# EAGLE design RTI-Dome-wire (EAGLE 7.7.0)
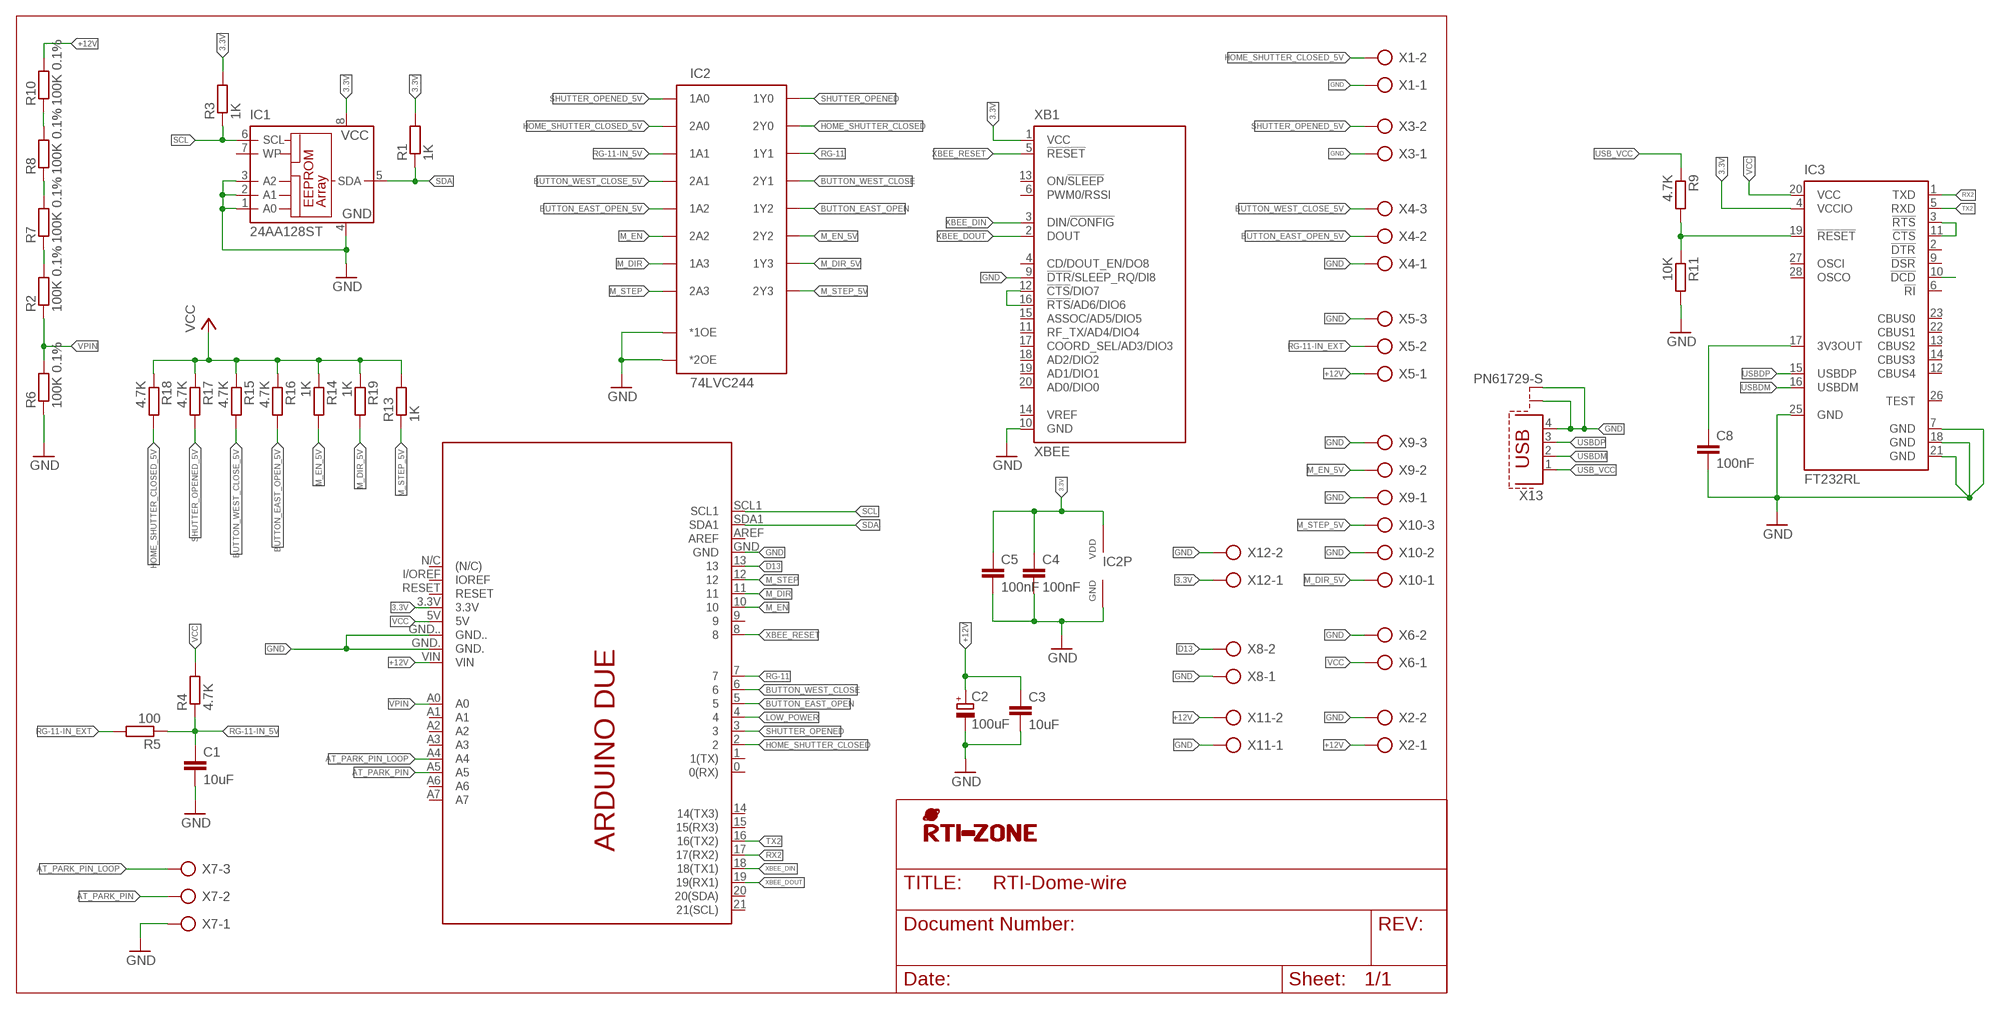
[diagram p0: schematic, sheet 1]

## Parts
C1  10uF  C-EU'0805'  [C0805]
C2  100uF  CPOL-EU  [UD-10X10_NICHICON]
C3  10uF  C-EU'0805'  [C0805]
C4  100nF  C-EU'0805'  [C0805]
C5  100nF  C-EU'0805'  [C0805]
C8  100nF  C-EU'0805'  [C0805]
IC1  24AA128ST  [TSSOP8]
IC2  74LVC244  [TSSOP20]
IC3  FT232RL  [SSOP28]
PCB1  ARDUINO_DUE_SHIELD_SHORT  [ARDUINO_DUE_SHIELD_SHORT]
R1  1K  R-EU'0805'  [R0805]
R2  100K 0.1%  R-EU'0805'  [R0805]
R3  1K  R-EU'0805'  [R0805]
R4  4.7K  R-EU'0805'  [R0805]
R5  100  R-EU'0805'  [R0805]
R6  100K 0.1%  R-EU'0805'  [R0805]
R7  100K 0.1%  R-EU'0805'  [R0805]
R8  100K 0.1%  R-EU'0805'  [R0805]
R9  4.7K  R-EU'0805'  [R0805]
R10  100K 0.1%  R-EU'0805'  [R0805]
R11  10K  R-EU'0805'  [R0805]
R13  1K  R-EU'0805'  [R0805]
R14  1K  R-EU'0805'  [R0805]
R15  4.7K  R-EU'0805'  [R0805]
R16  4.7K  R-EU'0805'  [R0805]
R17  4.7K  R-EU'0805'  [R0805]
R18  4.7K  R-EU'0805'  [R0805]
R19  1K  R-EU'0805'  [R0805]
U$4  RTI-LOGO_BIG  [LOGO_BIG]
X1  AK500/2  [AK500/2]
X2  AK500/2  [AK500/2]
X3  AK500/2  [AK500/2]
X4  AK500/3  [AK500/3]
X5  AK500/3  [AK500/3]
X6  AK500/2  [AK500/2]
X7  AK500/3  [AK500/3]
X8  AK500/2  [AK500/2]
X9  AK500/3  [AK500/3]
X10  AK500/3  [AK500/3]
X11  AK500/2  [AK500/2]
X12  AK500/2  [AK500/2]
X13  PN61729-S  [PN61729-S]
XB1  XBEE  [XBEE]

## Nets
3.3V: C4.1 C5.1 IC1.8(VCC) IC2.P$20(VDD) IC3.4(VCCIO) PCB1.3.3V R1.2 R3.2 X12.1 XB1.1(VCC)
+12V [+12V]: C2.+ C3.1 PCB1.VIN R10.2 X2.1 X5.1 X11.2
AT_PARK_PIN: PCB1.A5 X7.2
AT_PARK_PIN_LOOP: PCB1.A4 X7.3
BUTTON_EAST_OPEN: IC2.P$14(1Y2) PCB1.5
BUTTON_EAST_OPEN_5V: IC2.P$6(1A2) R16.2 X4.2
BUTTON_WEST_CLOSE: IC2.P$5(2Y1) PCB1.6
BUTTON_WEST_CLOSE_5V: IC2.P$15(2A1) R15.2 X4.3
D13: PCB1.13 X8.2
GND [GND]: C1.2 C2.- C3.2 C4.2 C5.2 C8.2 IC1.1(A0) IC1.2(A1) IC1.3(A2) IC1.4(GND) IC2.P$1(*1OE) IC2.P$10(GND) IC2.P$19(*2OE) IC3.7(GND) IC3.18(GND) IC3.21(GND) IC3.25(GND) PCB1.GND PCB1.GND. PCB1.GND.. R6.1 R11.2 X1.1 X2.2 X3.1 X4.1 X5.3 X6.2 X7.1 X8.1 X9.1 X9.3 X10.2 X11.1 X12.2 X13.4 X13.S1 X13.S2 XB1.9(!DTR!/SLEEP_RQ/DI8) XB1.10(GND)
HOME_SHUTTER_CLOSED: IC2.P$3(2Y0) PCB1.2
HOME_SHUTTER_CLOSED_5V: IC2.P$17(2A0) R18.2 X1.2
LOW_POWER: PCB1.4
M_DIR: IC2.P$8(1A3) PCB1.11
M_DIR_5V: IC2.P$12(1Y3) R19.2 X10.1
M_EN: IC2.P$13(2A2) PCB1.10
M_EN_5V: IC2.P$7(2Y2) R14.2 X9.2
M_STEP: IC2.P$11(2A3) PCB1.12
M_STEP_5V: IC2.P$9(2Y3) R13.1 X10.3
N$1: IC3.19(!RESET) R9.2 R11.1
N$2: R7.2 R8.1
N$3: R8.2 R10.1
N$4: IC3.3(!RTS) IC3.11(!CTS)
N$5: R2.2 R7.1
N$6: C8.1 IC3.17(3V3OUT)
N$9: XB1.12(!CTS!/DIO7) XB1.16(!RTS!/AD6/DIO6)
N$21: IC3.10(!DCD)
RG-11: IC2.P$16(1Y1) PCB1.7
RG-11-IN_5V: C1.1 IC2.P$4(1A1) R4.1 R5.1
RG-11-IN_EXT: R5.2 X5.2
RX2: IC3.1(TXD) PCB1.17(17(RX2))
SCL: IC1.6(SCL) PCB1.SCL1 R3.1
SDA: IC1.5(SDA) PCB1.SDA1 R1.1
SHUTTER_OPENED: IC2.P$18(1Y0) PCB1.3
SHUTTER_OPENED_5V: IC2.P$2(1A0) R17.2 X3.2
TX2: IC3.5(RXD) PCB1.16(16(TX2))
USB_VCC: R9.1 X13.1
USBDM: IC3.16(USBDM) X13.2
USBDP: IC3.15(USBDP) X13.3
VCC: IC3.20(VCC) PCB1.5V R4.2 R13.2 R14.1 R15.1 R16.1 R17.1 R18.1 R19.1 X6.1
VPIN: PCB1.A0 R2.1 R6.2
XBEE_DIN: PCB1.18(18(TX1)) XB1.3(DIN/!CONFIG)
XBEE_DOUT: PCB1.19(19(RX1)) XB1.2(DOUT)
XBEE_RESET: PCB1.8 XB1.5(!RESET)
Unconnected: IC1.7(WP) IC3.2(!DTR) IC3.6(!RI) IC3.9(!DSR) IC3.12(CBUS4) IC3.13(CBUS2) IC3.14(CBUS3) IC3.22(CBUS1) IC3.23(CBUS0) IC3.26(TEST) IC3.27(OSCI) IC3.28(OSCO) PCB1.0(0(RX)) PCB1.1(1(TX)) PCB1.9 PCB1.14(14(TX3)) PCB1.15(15(RX3)) PCB1.20(20(SDA)) PCB1.21(21(SCL)) PCB1.A1 PCB1.A2 PCB1.A3 PCB1.A6 PCB1.A7 PCB1.AREF PCB1.I/OREF(IOREF) PCB1.N/C((N/C)) PCB1.RESET XB1.4(CD/DOUT_EN/DO8) XB1.6(PWM0/RSSI) XB1.11(RF_TX/AD4/DIO4) XB1.13(ON/!SLEEP) XB1.14(VREF) XB1.15(ASSOC/AD5/DIO5) XB1.17(COORD_SEL/AD3/DIO3) XB1.18(AD2/DIO2) XB1.19(AD1/DIO1) XB1.20(AD0/DIO0)

## Library data of the parts
C1 C3-C5 C8 = rti:C-EU
C2 = rti:CPOL-EU
IC1 = microchip:24*: Serial EEPROM I2C; MF: MICROCHIP; MPN: 24AA128-I/ST; OC_FARNELL: unknown; OC_NEWARK: 92C6843
IC2 = rti:74*244
IC3 = ftdichip:FT232R: Source: http://www.ftdichip.com/Documents/DataSheets/DS_FT232R_v104.pdf; MPN: FT232RL; OC_FARNELL: 1146032; OC_NEWARK: 91K9918
PCB1 = arduino_shield:ARDUINO_DUE_SHIELD_SHORT: Device for representing an Arduino Due board with a footprint in an EAGLE design. Created by Dave Young for Element14. More EAGLE documentation at: http://www.element14.com/community/community/knode/cadsoft_eagle
R1-R11 R13-R19 = rti:R-EU
U$4 = rti:RTI-LOGO
X1-X3 X6 X8 X11 X12 = con-ptr500:AK500/2: CONNECTOR; OC_FARNELL: unknown; OC_NEWARK: unknown
X4 X5 X7 X9 X10 = con-ptr500:AK500/3: CONNECTOR; OC_FARNELL: unknown; OC_NEWARK: unknown
X13 = con-berg:PN61729-S: BERG USB connector; OC_FARNELL: unknown; OC_NEWARK: unknown
XB1 = maxstream:XBEE: XBee (TM) /XBee-PRO(TM) OEM RF Modules Source: MaxStream, Inc. xbee_productmanual.pdf; MPN: XBP24-Z7UIT-004; OC_FARNELL: 1751799; OC_NEWARK: 34R5507

## Net classes
0 default: width 0.254 mm, drill 0.3 mm, clearance 0.203 mm
1 +12V: width 0.254 mm, drill 0.3 mm, clearance 0.203 mm
2 GND: width 0.254 mm, drill 0.3 mm, clearance 0.203 mm

## Board
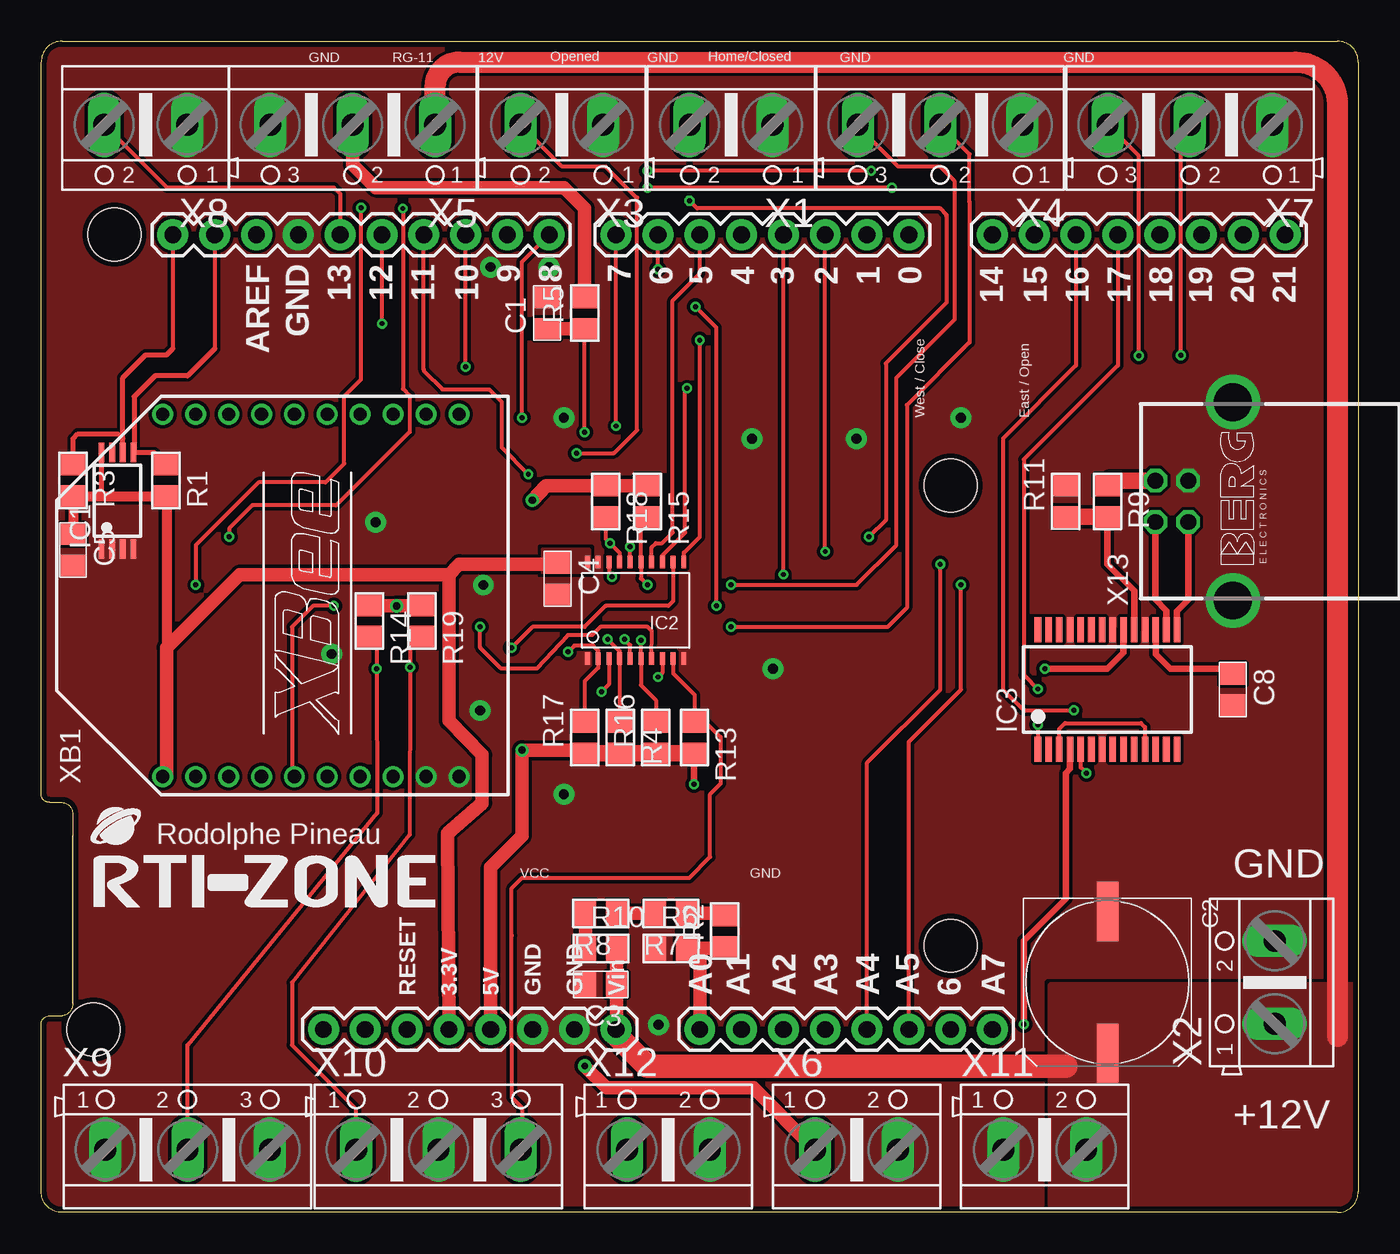
[diagram p1: board, top side]
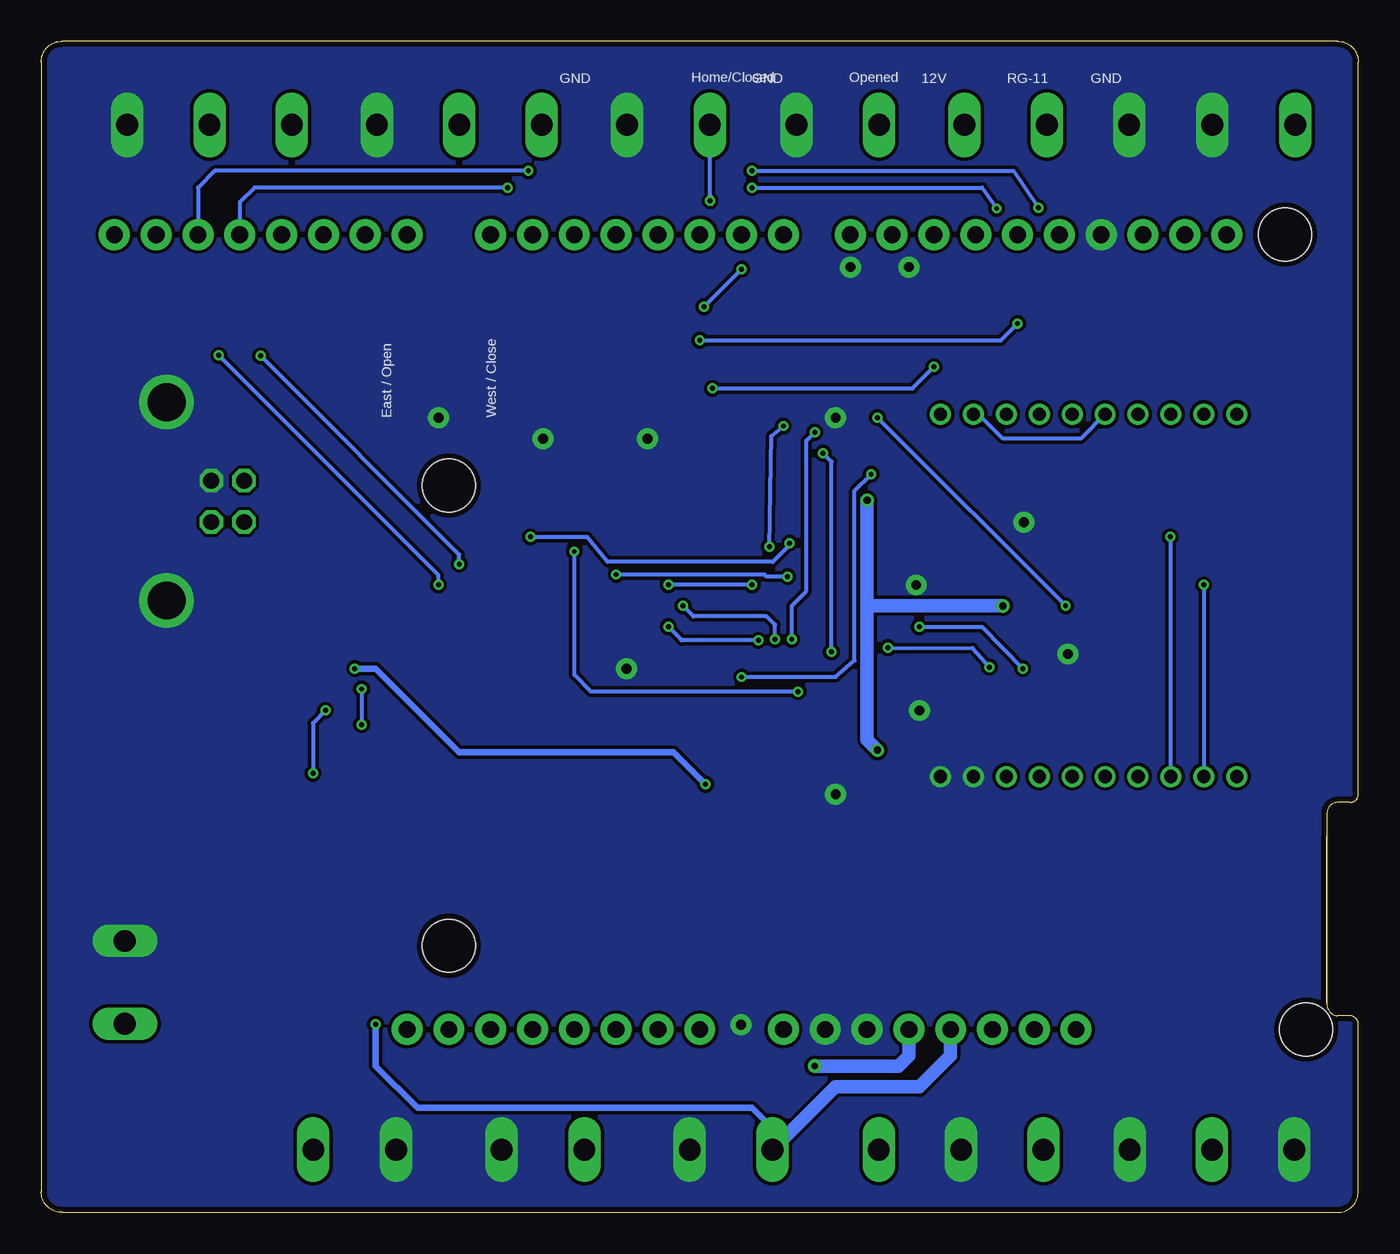
[diagram p2: board, bottom side, seen from below]

Size 80.01 x 71.12 mm. Coordinates in mm from the lower left corner, seen from the top.
Outline: 1.91,22.86 1.91,12.7
Outline: 1.91,12.7 1.91,22.86
Outline: 1.91,12.7 arc-90 1.27,11.94 0.51,11.94 arc90 0,11.43 0,1.27 arc90 1.27,0 78.74,0 arc90 80.01,1.27 80.01,69.85 arc90 78.74,71.12 1.27,71.12 arc90 0,69.85 0,25.4 arc90 0.51,24.89 1.27,24.89 arc-90 1.91,24.26 1.91,22.86
Copper layers (1*16): Top 0.07mm / dielectric 1.6mm / Bottom 0.07mm
Design rules "Fusion": minimum track width 8mil, minimum drill 0.3mm, track to track 8mil, track to pad 8mil, pad to pad 8mil, via to via 8mil, smd to smd 6mil, copper to edge 13mil, drill to drill 6mil, minimum pad ring 6mil, minimum via ring 6mil, stop-mask expansion 3mil, vias tented up to drill 130mil, thermal gap 8mil

### Footprints (pad centres in the part's own frame; a part is rotated, then mirrored left to right if it is on the bottom)
C0805 = smd 1.3 x 1.5: 1 -0.95,0; 2 0.95,0
UD-10X10_NICHICON = smd 3.6 x 1.3: + 4.3,0; - -4.3,0
TSSOP8 = smd 0.35 x 1.2: 1 -0.975,-2.925; 2 -0.325,-2.925; 3 0.325,-2.925; 4 0.975,-2.925; 5 0.975,2.925; 6 0.325,2.925; 7 -0.325,2.925; 8 -0.975,2.925
TSSOP20 = smd 0.75 x 0.3: P$1 -2.94,2.885; P$2 -2.94,2.235; P$3 -2.94,1.585; P$4 -2.94,0.935; P$5 -2.94,0.285; P$6 -2.94,-0.365; P$7 -2.94,-1.015; P$8 -2.94,-1.665; P$9 -2.94,-2.315; P$10 -2.94,-2.965; P$11 2.91,-2.965; P$12 2.91,-2.315; P$13 2.91,-1.665; P$14 2.91,-1.015; P$15 2.91,-0.365; P$16 2.91,0.285; P$17 2.91,0.935; P$18 2.91,1.585; P$19 2.91,2.235; P$20 2.91,2.885
SSOP28 = smd 0.4 x 1.5: 1 -4.225,-3.625; 2 -3.575,-3.625; 3 -2.925,-3.625; 4 -2.275,-3.625; 5 -1.625,-3.625; 6 -0.975,-3.625; 7 -0.325,-3.625; 8 0.325,-3.625; 9 0.975,-3.625; 10 1.625,-3.625; 11 2.275,-3.625; 12 2.925,-3.625; 13 3.575,-3.625; 14 4.225,-3.625; 15 4.225,3.625; 16 3.575,3.625; 17 2.925,3.625; 18 2.275,3.625; 19 1.625,3.625; 20 0.975,3.625; 21 0.325,3.625; 22 -0.325,3.625; 23 -0.975,3.625; 24 -1.625,3.625; 25 -2.275,3.625; 26 -2.925,3.625; 27 -3.575,3.625; 28 -4.225,3.625
ARDUINO_DUE_SHIELD_SHORT = drill 1.016 pad 1.88: 0 12.7,26.67; 1 10.16,26.67; 2 7.62,26.67; 3 5.08,26.67; 3.3V -15.24,-21.59; 4 2.54,26.67; 5 0,26.67; 5V -12.7,-21.59; 6 -2.54,26.67; 7 -5.08,26.67; 8 -9.144,26.67; 9 -11.684,26.67; 10 -14.224,26.67; 11 -16.764,26.67; 12 -19.304,26.67; 13 -21.844,26.67; 14 17.78,26.67; 15 20.32,26.67; 16 22.86,26.67; 17 25.4,26.67; 18 27.94,26.67; 19 30.48,26.67; 20 33.02,26.67; 21 35.56,26.67; A0 0,-21.59; A1 2.54,-21.59; A2 5.08,-21.59; A3 7.62,-21.59; A4 10.16,-21.59; A5 12.7,-21.59; A6 15.24,-21.59; A7 17.78,-21.59; AREF -26.924,26.67; GND -24.384,26.67; GND. -7.62,-21.59; GND.. -10.16,-21.59; I/OREF -20.32,-21.59; N/C -22.86,-21.59; RESET -17.78,-21.59; SCL1 -32.004,26.67; SDA1 -29.464,26.67; VIN -5.08,-21.59 | hole 3.2: -35.56,26.67; -36.83,-21.59; 15.24,11.43; 15.24,-16.51
R0805 = smd 1.3 x 1.5: 1 -0.95,0; 2 0.95,0
AK500/2 = drill 1.321 long: 1 -2.515,0; 2 2.515,0
AK500/3 = drill 1.321 long: 1 -5.004,0; 2 0,0; 3 5.004,0
PN61729-S = drill 0.95 octagon: 1 1.25,4.71; 2 -1.25,4.71; 3 -1.25,2.71; 4 1.25,2.71 | drill 2.3 pad 2.9: S1 -6.02,0; S2 6.02,0
XBEE = drill 0.8 pad 1.27: 1 -11,9; 2 -11,7; 3 -11,5; 4 -11,3; 5 -11,1; 6 -11,-1; 7 -11,-3; 8 -11,-5; 9 -11,-7; 10 -11,-9; 11 11,-9; 12 11,-7; 13 11,-5; 14 11,-3; 15 11,-1; 16 11,1; 17 11,3; 18 11,5; 19 11,7; 20 11,9

### Placement (x,y rotation side)
C1  30.73,54.61 90 top
C2  64.77,13.97 270 top
C3  34,13.84 180 top
C4  31.37,38.48 270 top
C5  1.94,40.23 270 top
C8  72.39,31.75 270 top
IC1  4.64,43.21 0 top
IC2  36.07,36.58 90 top
IC3  64.77,31.75 0 top
PCB1  40.01,32.7 0 top
R1  7.59,44.45 270 top
R2  41.53,17.08 90 top
R3  1.94,44.45 270 top
R4  35.18,28.83 270 top
R5  33.02,54.61 90 top
R6  38.26,16.03 0 top
R7  38.26,18.16 180 top
R8  34,18.16 180 top
R9  64.77,43.18 270 top
R10  34,16.03 0 top
R11  62.23,43.18 90 top
R13  39.69,28.83 270 top
R14  19.94,35.91 270 top
R15  36.83,43.18 270 top
R16  37.34,28.83 90 top
R17  33.02,28.83 90 top
R18  34.29,43.18 270 top
R19  23.11,35.91 270 top
U$4  3.17,18.54 0 top
X1  41.91,66.04 180 top
X2  74.93,13.97 90 top
X3  31.62,66.04 180 top
X4  54.61,66.04 180 top
X5  18.92,66.04 180 top
X6  49.53,3.81 0 top
X7  69.79,66.04 180 top
X8  6.35,66.04 180 top
X9  8.89,3.81 0 top
X10  24.13,3.81 0 top
X11  60.96,3.81 0 top
X12  38.1,3.81 0 top
X13  72.39,43.18 90 top
XB1  16.38,37.47 90 top

### Tracks (layer width: path | path; a pad name or v marks a point on that pad's centre or on a via)
3.3V  (via drill 0.3)
  Top 0.305: IC1.8 3.66,43.65 3.81,43.5
  Top 0.406: 31.43,39.49 C4.1 | IC3.4 62.49,26.93 62.23,26.67 62.23,19.05 59.69,16.51 v59.69,11.43
  Top 0.61: 7.62,34.29 7.62,43.47 arc90 R1.2 3.81,43.5 R3.2 C5.1
  Top 0.813: 24.77,38.73 25.4,39.37 31.31,39.37 C4.1 | 24.77,38.73 12.06,38.73 7.62,34.29 7.62,26.7 XB1.1 | PCB1.3.3V 24.7,23.02 26.8,24.86 26.8,27.78 24.77,29.84 24.77,38.73
  Bottom 0.406: v59.69,11.43 59.69,8.89 57.15,6.35 36.83,6.35 35.56,5.08 35.56,3.83 X12.1
  Bottom 0.813: PCB1.3.3V 24.77,9.53 26.67,7.62 31.77,7.62 X12.1
  pour Top (isolate 0.254, no thermals): 30.48,40.26 33.27,40.26 33.27,38.86 30.48,38.86
+12V
  Top 0.813: R10.2 C3.1 34.95,11.14 PCB1.VIN
  Top 1.27: 78.74,10.67 78.74,34.29 78.74,67.31 arc90 76.2,69.85 25.4,69.85 arc90 23.93,68.38 X5.1
  Top 1.422: PCB1.VIN 34.92,10.79 36.83,8.89 62.23,8.89
  pour Top (no thermals): 61.31,13.84 79.88,13.84 79.88,0 61.31,0
AT_PARK_PIN  (via drill 0.3)
  Top 0.254: PCB1.A5 52.7,28.57 55.88,31.75 v55.88,38.1 | v69.22,52.04 69.22,65.47 X7.2
  Bottom 0.254: v55.88,38.1 55.88,38.7 v69.22,52.04
AT_PARK_PIN_LOOP  (via drill 0.3)
  Top 0.254: PCB1.A4 50.16,27.3 54.61,31.75 v54.61,39.37 | v66.67,52.01 66.67,64.15 X7.3
  Bottom 0.254: v54.61,39.37 54.61,39.94 v66.67,52.01
BUTTON_EAST_OPEN
  Top 0.254: PCB1.5 40.01,57.02 38.35,55.37 38.35,41.27 37.72,40.64 37.34,40.64 37.08,40.38 IC2.P$14
BUTTON_EAST_OPEN_5V  (via drill 0.3)
  Top 0.254: v41.91,35.56 51.44,35.56 52.58,36.7 52.58,49.02 56.39,52.83 56.39,61.34 56.39,64.26 X4.2 | R16.2 37.34,31.11 36.45,32.01 36.43,32.02 IC2.P$6 36.43,34.72 v36.45,34.73
  Bottom 0.254: v41.91,35.56 41.15,34.8 41.08,34.73 v36.45,34.73
BUTTON_WEST_CLOSE  (via drill 0.3)
  Top 0.254: v41.02,36.83 41.02,53.72 v39.75,54.99 | v37.47,57.28 PCB1.6 | IC2.P$5 35.78,34.45 v35.43,34.8
  Bottom 0.254: v35.43,34.8 35.43,35.69 35.94,36.2 40.39,36.2 v41.02,36.83 | v39.75,54.99 v37.47,57.28
BUTTON_WEST_CLOSE_5V  (via drill 0.3)
  Top 0.254: v41.91,38.1 49.53,38.1 51.94,40.51 51.94,50.67 55.5,54.23 55.5,62.61 54.61,63.5 52.07,63.5 49.53,66.04 X4.3 | v36.83,38.1 36.43,38.5 IC2.P$15 36.43,41.83 R15.2
  Bottom 0.254: v36.83,38.1 v41.91,38.1
D13
  Top 0.254: X8.2 7.64,62.23 17.78,62.23 18.16,61.85 PCB1.13
GND  (via drill 0.6 pad 1.27)
  other vias: 44.45,33.02 26.86,38.1 43.18,46.99 31.75,25.4 26.67,30.48 31.75,48.26 30.86,57.4 27.3,57.4 20.32,41.91 17.65,33.91 49.53,46.99 55.88,48.26 37.5,11.4
  pour Bottom (rank 2, no thermals): 0,0 0,71.12 80.01,71.12 80.01,0
  pour Top (rank 2, no thermals): 0,0 0,71.12 80.01,71.12 80.01,0
HOME_SHUTTER_CLOSED  (via drill 0.3)
  Top 0.254: v47.62,40.13 PCB1.2 | IC2.P$3 34.48,32.07 v34.04,31.62
  Bottom 0.254: v34.04,31.62 46.61,31.62 47.62,32.64 v47.62,40.13
HOME_SHUTTER_CLOSED_5V  (via drill 0.3)
  Top 0.254: R18.2 34.29,40.89 v34.54,40.64 35.13,40.05 IC2.P$17 | v50.29,41.02 51.31,42.04 51.31,51.56 54.99,55.24 54.99,60.45 54.99,60.58 54.61,60.96 39.85,60.96 v39.37,61.44
  Bottom 0.254: v34.54,40.64 34.54,40.51 35.56,39.5 45.59,39.5 46.86,41.02 v50.29,41.02 | v39.37,61.44 39.37,64.75 X1.2
M_DIR  (via drill 0.3)
  Top 0.254: PCB1.11 23.24,51.18 23.24,51.12 24.38,49.97 27.21,49.97 27.97,49.21 27.97,46.45 v29.59,44.83 | IC2.P$8 37.73,32.78 v37.47,32.51
  Bottom 0.254: v37.47,32.51 31.75,32.51 30.61,33.53 30.61,43.81 v29.59,44.83
M_DIR_5V  (via drill 0.3)
  Top 0.254: IC2.P$12 38.4,37.12 38.1,36.83 34.29,36.83 33.02,35.56 29.84,35.56 v28.57,34.29 | R19.2 22.42,34.26 v22.42,33.12 22.38,22.95 15.24,13.97 15.24,10.16 19.13,6.27 X10.1
  Bottom 0.254: v28.57,34.29 23.43,34.26 v22.42,33.12
M_EN  (via drill 0.3)
  Top 0.254: v39.24,50.04 39.12,49.91 39.12,41.27 37.73,39.89 IC2.P$13 | v25.78,51.34 PCB1.10
  Bottom 0.254: v39.24,50.04 27.08,50.04 v25.78,51.34
M_EN_5V  (via drill 0.3)
  Top 0.254: IC2.P$7 37.09,35.3 36.83,35.56 33.97,35.56 33.47,35.05 32,35.05 30.1,33.02 27.94,33.02 26.67,34.29 v26.67,35.56 | R14.2 20.38,34.52 v20.38,33.02 20.41,24.26 8.89,10.16 X9.2
  Bottom 0.254: v26.67,35.56 22.86,35.56 v20.38,33.02
M_STEP  (via drill 0.3)
  Top 0.254: IC2.P$11 39.05,40.06 40.01,41.02 v40.01,52.96 | v20.7,53.98 PCB1.12
  Bottom 0.254: v40.01,52.96 21.72,52.96 v20.7,53.98
M_STEP_5V
  Top 0.254: X10.3 29.21,3.89 29.21,6.35 28.57,6.99 28.57,10.48 28.57,16.83 28.57,19.68 29.21,20.32 39.37,20.32 40.64,21.59 40.64,25.4 41.27,26.04 41.27,28.86 40.36,29.78 R13.1 39.69,31.43 38.4,32.73 38.38,32.74 IC2.P$9
N$1
  Top 0.406: IC3.19 66.39,37.74 64.77,39.37 R9.2
  Top 1.016: R11.1 R9.2
N$2
  Top 0.813: R8.1 R7.2
N$3
  Top 0.813: R8.2 R10.1
N$4
  Top 0.254: IC3.3 61.84,29.36 62.2,29.72 66.8,29.72 67.06,29.46 67.06,28.14 IC3.11
N$5
  Top 0.813: R7.1 41.4,18.16 R2.2
N$6
  Top 0.406: IC3.17 67.69,33.91 68.58,33.02 72.26,33.02 C8.1
N$9
  Bottom 0.254: XB1.16 16.86,46.99 21.59,46.99 23.07,48.47 XB1.12
RG-11  (via drill 0.3)
  Top 0.254: v34.92,47.75 PCB1.7 | IC2.P$16 v35.78,40.42
  Bottom 0.254: v35.78,40.42 35.66,47.15 v34.92,47.75
RG-11-IN_5V  (via drill 0.3)
  Top 0.254: 35.15,29.81 R4.1 35.13,29.82 IC2.P$4 35.13,34.08 v34.42,34.8 | v33.02,47.37 R5.1
  Top 0.813: C1.1 R5.1
  Bottom 0.254: v34.42,34.8 34.42,36.83 33.53,37.72 33.53,46.86 v33.02,47.37
RG-11-IN_EXT
  Top 0.813: R5.2 33.02,60.96 31.75,62.23 20.32,62.23 18.92,63.63 X5.2
RX2  (via drill 0.3)
  Top 0.254: PCB1.17 65.41,51.44 59.69,45.72 59.69,32.64 v60.55,31.78 | v60.55,29.62 IC3.1
  Top 0.406: IC3.1
  Bottom 0.254: v60.55,31.78 v60.55,29.62
SCL
  Top 0.254: PCB1.SCL1 8,52.45
  Top 0.305: IC1.6 4.96,46.99 | 4.96,46.99 4.96,50.68 6.35,52.07 7.62,52.07 8,52.45 | R3.1 1.94,46.99 2.22,47.28 4.67,47.28 4.96,46.99
SDA
  Top 0.254: PCB1.SDA1 10.54,52.45
  Top 0.305: 10.54,52.45 8.89,50.8 6.92,50.8 5.65,49.53 5.65,46.18 IC1.5 6.85,46.14 R1.1
SHUTTER_OPENED  (via drill 0.3)
  Top 0.254: v45.09,38.73 PCB1.3 | IC2.P$18 34.48,38.8 v34.67,38.61
  Bottom 0.254: v34.67,38.61 35.94,38.61 36.07,38.73 v45.09,38.73
SHUTTER_OPENED_5V  (via drill 0.3)
  Top 0.254: R17.2 33.02,32.26 33.83,33.07 IC2.P$2 33.83,34.11 33.53,34.42 32.38,34.42 v32,34.04 | v32.51,46.1 34.8,46.1 36.2,47.5 36.2,61.62 36.17,61.62 34.29,63.5 31.65,63.5 X3.2
  Bottom 0.254: v32,34.04 32,45.59 v32.51,46.1
TX2  (via drill 0.3)
  Top 0.254: PCB1.16 62.87,51.44 58.42,46.99 58.42,31.75 59.69,30.48 v62.74,30.48 | v63.5,26.67 63.15,27.02 IC3.5
  Top 0.406: 63.15,28.13 IC3.5
  Bottom 0.254: v62.74,30.48 63.5,29.72 v63.5,26.67
USB_VCC
  Top 1.016: X13.1 64.94,44.43 R9.1
USBDM
  Top 0.406: X13.2 67.68,37.22 68.36,36.54 68.36,35.39 IC3.16
USBDP
  Top 0.406: X13.3 69.68,37.2 68.99,36.51 IC3.15
VCC  (via drill 0.3, 0.4 pad 0.81, 0.45 pad 0.81)
  Top 0.406: R19.1 23.09,36.83 | R14.1 19.97,36.83 | IC3.20 65.75,33.99 64.77,33.02 v60.96,33.02 | v39.66,26 39.66,27.85 R13.2
  Top 0.813: PCB1.5V 27.3,20.95 29.21,22.86 29.21,24.26 v29.21,28.07 32.83,28.07 R17.1 | R15.1 R18.1 30.67,44.13 v29.84,43.24 | 23.09,36.83 v21.59,36.83 19.97,36.83 | v33.02,8.89 34.35,7.56 43.27,7.56 X6.1
  Top 1.016: R17.1 R4.2 R16.1 R13.2
  Bottom 0.406: v60.96,33.02 59.69,33.02 54.61,27.94 43.18,27.94 41.59,27.94 v39.66,26
  Bottom 0.813: v29.84,43.24 29.84,36.83 | 29.84,36.83 29.84,28.7 v29.21,28.07 | v21.59,36.83 29.84,36.83 | PCB1.5V 27.3,9.53 27.94,8.89 v33.02,8.89
VPIN
  Top 0.813: PCB1.A0 40.01,15.24 R6.2 41.43,16.03 R2.1
XBEE_DIN  (via drill 0.3)
  Top 0.254: v51.69,62.23 v36.83,62.23 | v11.43,41.02 11.43,41.53 12.83,42.93 17.91,42.93 22.38,47.4 22.38,49.59 21.97,50.01 v21.97,60.96
  Bottom 0.254: v36.83,62.23 22.86,62.23 v21.97,60.96 | v11.43,41.02 11.43,26.51 | v51.69,62.23 67.06,62.23 67.94,61.34 PCB1.18
  Bottom 0.305: 11.43,26.51 XB1.3
XBEE_DOUT  (via drill 0.3)
  Top 0.254: v50.42,63.25 v36.83,63.25 | v9.4,38.1 9.4,40.51 13.21,44.32 17.27,44.32 18.41,45.47 18.41,49.56 19.43,50.58 v19.43,60.99
  Bottom 0.254: v36.83,63.25 20.95,63.25 v19.43,60.99 | v9.4,38.1 9.4,26.48 XB1.2 | v50.42,63.25 69.47,63.25 70.48,62.23 PCB1.19
XBEE_RESET  (via drill 0.3)
  Top 0.254: v17.78,36.83 16.51,36.83 15.24,35.56 15.24,26.61 XB1.5 | v29.21,48.26 29.21,57.72 PCB1.8
  Bottom 0.254: v29.21,48.26 v17.78,36.83

### Text on the board
tPlace: GND | RG-11 | 12V | Opened | GND | Home/Closed | GND | GND | West / Close | East / Open | VCC | GND | GND | +12V
bPlace: GND | RG-11 | 12V | Opened | GND | Home/Closed | GND | West / Close | East / Open